# EAGLE design LEDArray1 (EAGLE 6.0)
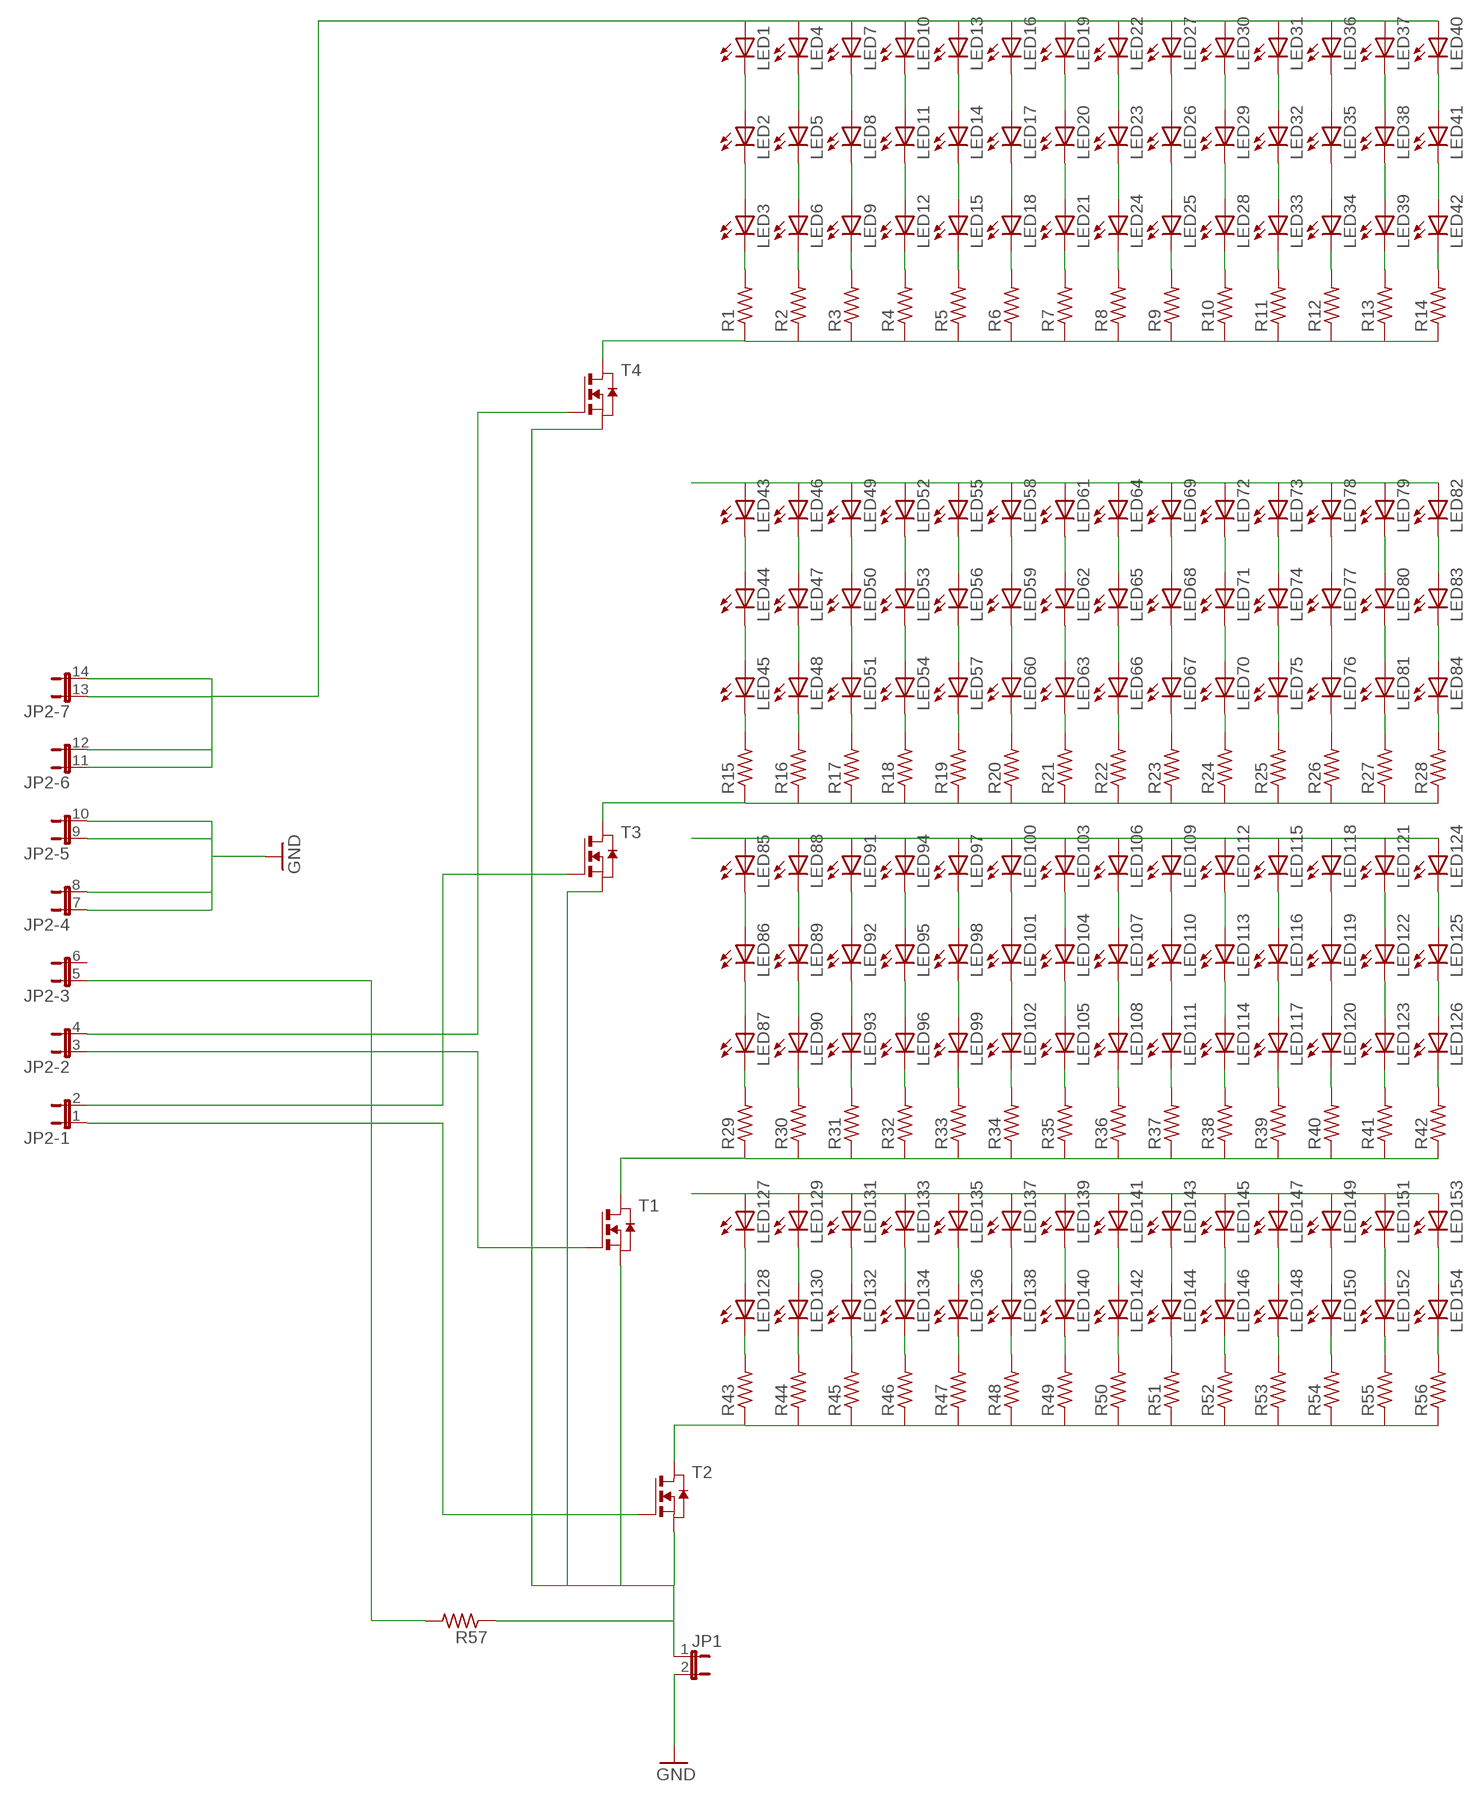
[diagram p0: schematic, sheet 1]

## Parts
JP1  JP1E  [JP1]
JP2  JP7QE  [JP7Q]
LED1  LED5MM  [LED5MM]
LED2  LED5MM  [LED5MM]
LED3  LED5MM  [LED5MM]
LED4  LED5MM  [LED5MM]
LED5  LED5MM  [LED5MM]
LED6  LED5MM  [LED5MM]
LED7  LED5MM  [LED5MM]
LED8  LED5MM  [LED5MM]
LED9  LED5MM  [LED5MM]
LED10  LED5MM  [LED5MM]
LED11  LED5MM  [LED5MM]
LED12  LED5MM  [LED5MM]
LED13  LED5MM  [LED5MM]
LED14  LED5MM  [LED5MM]
LED15  LED5MM  [LED5MM]
LED16  LED5MM  [LED5MM]
LED17  LED5MM  [LED5MM]
LED18  LED5MM  [LED5MM]
LED19  LED5MM  [LED5MM]
LED20  LED5MM  [LED5MM]
LED21  LED5MM  [LED5MM]
LED22  LED5MM  [LED5MM]
LED23  LED5MM  [LED5MM]
LED24  LED5MM  [LED5MM]
LED25  LED5MM  [LED5MM]
LED26  LED5MM  [LED5MM]
LED27  LED5MM  [LED5MM]
LED28  LED5MM  [LED5MM]
LED29  LED5MM  [LED5MM]
LED30  LED5MM  [LED5MM]
LED31  LED5MM  [LED5MM]
LED32  LED5MM  [LED5MM]
LED33  LED5MM  [LED5MM]
LED34  LED5MM  [LED5MM]
LED35  LED5MM  [LED5MM]
LED36  LED5MM  [LED5MM]
LED37  LED5MM  [LED5MM]
LED38  LED5MM  [LED5MM]
LED39  LED5MM  [LED5MM]
LED40  LED5MM  [LED5MM]
LED41  LED5MM  [LED5MM]
LED42  LED5MM  [LED5MM]
LED43  LED5MM  [LED5MM]
LED44  LED5MM  [LED5MM]
LED45  LED5MM  [LED5MM]
LED46  LED5MM  [LED5MM]
LED47  LED5MM  [LED5MM]
LED48  LED5MM  [LED5MM]
LED49  LED5MM  [LED5MM]
LED50  LED5MM  [LED5MM]
LED51  LED5MM  [LED5MM]
LED52  LED5MM  [LED5MM]
LED53  LED5MM  [LED5MM]
LED54  LED5MM  [LED5MM]
LED55  LED5MM  [LED5MM]
LED56  LED5MM  [LED5MM]
LED57  LED5MM  [LED5MM]
LED58  LED5MM  [LED5MM]
LED59  LED5MM  [LED5MM]
LED60  LED5MM  [LED5MM]
LED61  LED5MM  [LED5MM]
LED62  LED5MM  [LED5MM]
LED63  LED5MM  [LED5MM]
LED64  LED5MM  [LED5MM]
LED65  LED5MM  [LED5MM]
LED66  LED5MM  [LED5MM]
LED67  LED5MM  [LED5MM]
LED68  LED5MM  [LED5MM]
LED69  LED5MM  [LED5MM]
LED70  LED5MM  [LED5MM]
LED71  LED5MM  [LED5MM]
LED72  LED5MM  [LED5MM]
LED73  LED5MM  [LED5MM]
LED74  LED5MM  [LED5MM]
LED75  LED5MM  [LED5MM]
LED76  LED5MM  [LED5MM]
LED77  LED5MM  [LED5MM]
LED78  LED5MM  [LED5MM]
LED79  LED5MM  [LED5MM]
LED80  LED5MM  [LED5MM]
LED81  LED5MM  [LED5MM]
LED82  LED5MM  [LED5MM]
LED83  LED5MM  [LED5MM]
LED84  LED5MM  [LED5MM]
LED85  LED5MM  [LED5MM]
LED86  LED5MM  [LED5MM]
LED87  LED5MM  [LED5MM]
LED88  LED5MM  [LED5MM]
LED89  LED5MM  [LED5MM]
LED90  LED5MM  [LED5MM]
LED91  LED5MM  [LED5MM]
LED92  LED5MM  [LED5MM]
LED93  LED5MM  [LED5MM]
LED94  LED5MM  [LED5MM]
LED95  LED5MM  [LED5MM]
LED96  LED5MM  [LED5MM]
LED97  LED5MM  [LED5MM]
LED98  LED5MM  [LED5MM]
LED99  LED5MM  [LED5MM]
LED100  LED5MM  [LED5MM]
LED101  LED5MM  [LED5MM]
LED102  LED5MM  [LED5MM]
LED103  LED5MM  [LED5MM]
LED104  LED5MM  [LED5MM]
LED105  LED5MM  [LED5MM]
LED106  LED5MM  [LED5MM]
LED107  LED5MM  [LED5MM]
LED108  LED5MM  [LED5MM]
LED109  LED5MM  [LED5MM]
LED110  LED5MM  [LED5MM]
LED111  LED5MM  [LED5MM]
LED112  LED5MM  [LED5MM]
LED113  LED5MM  [LED5MM]
LED114  LED5MM  [LED5MM]
LED115  LED5MM  [LED5MM]
LED116  LED5MM  [LED5MM]
LED117  LED5MM  [LED5MM]
LED118  LED5MM  [LED5MM]
LED119  LED5MM  [LED5MM]
LED120  LED5MM  [LED5MM]
LED121  LED5MM  [LED5MM]
LED122  LED5MM  [LED5MM]
LED123  LED5MM  [LED5MM]
LED124  LED5MM  [LED5MM]
LED125  LED5MM  [LED5MM]
LED126  LED5MM  [LED5MM]
LED127  LED5MM  [LED5MM]
LED128  LED5MM  [LED5MM]
LED129  LED5MM  [LED5MM]
LED130  LED5MM  [LED5MM]
LED131  LED5MM  [LED5MM]
LED132  LED5MM  [LED5MM]
LED133  LED5MM  [LED5MM]
LED134  LED5MM  [LED5MM]
LED135  LED5MM  [LED5MM]
LED136  LED5MM  [LED5MM]
LED137  LED5MM  [LED5MM]
LED138  LED5MM  [LED5MM]
LED139  LED5MM  [LED5MM]
LED140  LED5MM  [LED5MM]
LED141  LED5MM  [LED5MM]
LED142  LED5MM  [LED5MM]
LED143  LED5MM  [LED5MM]
LED144  LED5MM  [LED5MM]
LED145  LED5MM  [LED5MM]
LED146  LED5MM  [LED5MM]
LED147  LED5MM  [LED5MM]
LED148  LED5MM  [LED5MM]
LED149  LED5MM  [LED5MM]
LED150  LED5MM  [LED5MM]
LED151  LED5MM  [LED5MM]
LED152  LED5MM  [LED5MM]
LED153  LED5MM  [LED5MM]
LED154  LED5MM  [LED5MM]
R1  R-US_R0805  [R0805]
R2  R-US_R0805  [R0805]
R3  R-US_R0805  [R0805]
R4  R-US_R0805  [R0805]
R5  R-US_R0805  [R0805]
R6  R-US_R0805  [R0805]
R7  R-US_R0805  [R0805]
R8  R-US_R0805  [R0805]
R9  R-US_R0805  [R0805]
R10  R-US_R0805  [R0805]
R11  R-US_R0805  [R0805]
R12  R-US_R0805  [R0805]
R13  R-US_R0805  [R0805]
R14  R-US_R0805  [R0805]
R15  R-US_R0805  [R0805]
R16  R-US_R0805  [R0805]
R17  R-US_R0805  [R0805]
R18  R-US_R0805  [R0805]
R19  R-US_R0805  [R0805]
R20  R-US_R0805  [R0805]
R21  R-US_R0805  [R0805]
R22  R-US_R0805  [R0805]
R23  R-US_R0805  [R0805]
R24  R-US_R0805  [R0805]
R25  R-US_R0805  [R0805]
R26  R-US_R0805  [R0805]
R27  R-US_R0805  [R0805]
R28  R-US_R0805  [R0805]
R29  R-US_R0805  [R0805]
R30  R-US_R0805  [R0805]
R31  R-US_R0805  [R0805]
R32  R-US_R0805  [R0805]
R33  R-US_R0805  [R0805]
R34  R-US_R0805  [R0805]
R35  R-US_R0805  [R0805]
R36  R-US_R0805  [R0805]
R37  R-US_R0805  [R0805]
R38  R-US_R0805  [R0805]
R39  R-US_R0805  [R0805]
R40  R-US_R0805  [R0805]
R41  R-US_R0805  [R0805]
R42  R-US_R0805  [R0805]
R43  R-US_R0805  [R0805]
R44  R-US_R0805  [R0805]
R45  R-US_R0805  [R0805]
R46  R-US_R0805  [R0805]
R47  R-US_R0805  [R0805]
R48  R-US_R0805  [R0805]
R49  R-US_R0805  [R0805]
R50  R-US_R0805  [R0805]
R51  R-US_R0805  [R0805]
R52  R-US_R0805  [R0805]
R53  R-US_R0805  [R0805]
R54  R-US_R0805  [R0805]
R55  R-US_R0805  [R0805]
R56  R-US_R0805  [R0805]
R57  R-US_R0805  [R0805]
T1  NMOSSOT23  [SOT-23]
T2  NMOSSOT23  [SOT-23]
T3  NMOSSOT23  [SOT-23]
T4  NMOSSOT23  [SOT-23]

## Nets
GND: JP1.2 JP2.7 JP2.8 JP2.9 JP2.10
N$1: LED1.K(C) LED2.A
N$2: LED4.K(C) LED5.A
N$3: LED7.K(C) LED8.A
N$4: LED10.K(C) LED11.A
N$5: LED13.K(C) LED14.A
N$6: LED16.K(C) LED17.A
N$7: LED19.K(C) LED20.A
N$8: LED22.K(C) LED23.A
N$9: LED26.A LED27.K(C)
N$10: LED29.A LED30.K(C)
N$11: LED31.K(C) LED32.A
N$12: LED35.A LED36.K(C)
N$13: LED37.K(C) LED38.A
N$14: LED40.K(C) LED41.A
N$15: LED41.K(C) LED42.A
N$16: LED38.K(C) LED39.A
N$17: LED34.A LED35.K(C)
N$18: LED32.K(C) LED33.A
N$19: LED28.A LED29.K(C)
N$20: LED25.A LED26.K(C)
N$21: LED23.K(C) LED24.A
N$22: LED20.K(C) LED21.A
N$23: LED17.K(C) LED18.A
N$24: LED14.K(C) LED15.A
N$25: LED11.K(C) LED12.A
N$26: LED8.K(C) LED9.A
N$27: LED5.K(C) LED6.A
N$28: LED2.K(C) LED3.A
N$29: R1.1 R2.1 R3.1 R4.1 R5.1 R6.1 R7.1 R8.1 R9.1 R10.1 R11.1 R12.1 R13.1 R14.1 T4.1(D)
N$30: LED43.K(C) LED44.A
N$31: LED46.K(C) LED47.A
N$32: LED49.K(C) LED50.A
N$33: LED52.K(C) LED53.A
N$34: LED55.K(C) LED56.A
N$35: LED58.K(C) LED59.A
N$36: LED61.K(C) LED62.A
N$37: LED64.K(C) LED65.A
N$38: LED68.A LED69.K(C)
N$39: LED71.A LED72.K(C)
N$40: LED73.K(C) LED74.A
N$41: LED77.A LED78.K(C)
N$42: LED79.K(C) LED80.A
N$43: LED82.K(C) LED83.A
N$44: LED83.K(C) LED84.A
N$45: LED80.K(C) LED81.A
N$46: LED76.A LED77.K(C)
N$47: LED74.K(C) LED75.A
N$48: LED70.A LED71.K(C)
N$49: LED67.A LED68.K(C)
N$50: LED65.K(C) LED66.A
N$51: LED62.K(C) LED63.A
N$52: LED59.K(C) LED60.A
N$53: LED56.K(C) LED57.A
N$54: LED53.K(C) LED54.A
N$55: LED50.K(C) LED51.A
N$56: LED47.K(C) LED48.A
N$57: LED44.K(C) LED45.A
N$58: R15.1 R16.1 R17.1 R18.1 R19.1 R20.1 R21.1 R22.1 R23.1 R24.1 R25.1 R26.1 R27.1 R28.1 T3.1(D)
N$59: LED85.K(C) LED86.A
N$60: LED86.K(C) LED87.A
N$61: LED88.K(C) LED89.A
N$62: LED91.K(C) LED92.A
N$63: LED94.K(C) LED95.A
N$64: LED97.K(C) LED98.A
N$65: LED100.K(C) LED101.A
N$66: LED103.K(C) LED104.A
N$67: LED106.K(C) LED107.A
N$68: LED109.K(C) LED110.A
N$69: LED112.K(C) LED113.A
N$70: LED115.K(C) LED116.A
N$71: LED118.K(C) LED119.A
N$72: LED121.K(C) LED122.A
N$73: LED124.K(C) LED125.A
N$74: LED125.K(C) LED126.A
N$75: LED122.K(C) LED123.A
N$76: LED119.K(C) LED120.A
N$77: LED116.K(C) LED117.A
N$78: LED113.K(C) LED114.A
N$79: LED110.K(C) LED111.A
N$80: LED107.K(C) LED108.A
N$81: LED104.K(C) LED105.A
N$82: LED101.K(C) LED102.A
N$83: LED98.K(C) LED99.A
N$84: LED95.K(C) LED96.A
N$85: LED92.K(C) LED93.A
N$86: LED89.K(C) LED90.A
N$87: R29.1 R30.1 R31.1 R32.1 R33.1 R34.1 R35.1 R36.1 R37.1 R38.1 R39.1 R40.1 R41.1 R42.1 T1.1(D)
N$88: LED127.K(C) LED128.A
N$89: LED129.K(C) LED130.A
N$90: LED131.K(C) LED132.A
N$91: LED133.K(C) LED134.A
N$92: LED135.K(C) LED136.A
N$93: LED137.K(C) LED138.A
N$94: LED139.K(C) LED140.A
N$95: LED141.K(C) LED142.A
N$96: LED143.K(C) LED144.A
N$97: LED145.K(C) LED146.A
N$98: LED147.K(C) LED148.A
N$99: LED149.K(C) LED150.A
N$100: LED151.K(C) LED152.A
N$101: LED153.K(C) LED154.A
N$102: R43.1 R44.1 R45.1 R46.1 R47.1 R48.1 R49.1 R50.1 R51.1 R52.1 R53.1 R54.1 R55.1 R56.1 T2.1(D)
N$103: JP2.3 T1.3(G)
N$104: JP2.5 R57.2
N$106: LED42.K(C) R14.2
N$107: LED39.K(C) R13.2
N$108: LED34.K(C) R12.2
N$109: LED33.K(C) R11.2
N$110: LED28.K(C) R10.2
N$111: LED25.K(C) R9.2
N$112: LED24.K(C) R8.2
N$113: LED21.K(C) R7.2
N$114: LED18.K(C) R6.2
N$115: LED15.K(C) R5.2
N$116: LED12.K(C) R4.2
N$117: LED9.K(C) R3.2
N$118: LED6.K(C) R2.2
N$119: LED3.K(C) R1.2
N$120: LED45.K(C) R15.2
N$121: LED48.K(C) R16.2
N$122: LED51.K(C) R17.2
N$123: LED54.K(C) R18.2
N$124: LED57.K(C) R19.2
N$125: LED60.K(C) R20.2
N$126: LED63.K(C) R21.2
N$127: LED66.K(C) R22.2
N$128: LED67.K(C) R23.2
N$129: LED70.K(C) R24.2
N$130: LED75.K(C) R25.2
N$131: LED76.K(C) R26.2
N$132: LED81.K(C) R27.2
N$133: LED84.K(C) R28.2
N$134: LED87.K(C) R29.2
N$135: LED90.K(C) R30.2
N$136: LED93.K(C) R31.2
N$137: LED96.K(C) R32.2
N$138: LED99.K(C) R33.2
N$139: LED102.K(C) R34.2
N$140: LED105.K(C) R35.2
N$141: LED108.K(C) R36.2
N$142: LED111.K(C) R37.2
N$143: LED114.K(C) R38.2
N$144: LED117.K(C) R39.2
N$145: LED120.K(C) R40.2
N$146: LED123.K(C) R41.2
N$147: LED126.K(C) R42.2
N$148: LED128.K(C) R43.2
N$149: LED130.K(C) R44.2
N$150: LED132.K(C) R45.2
N$151: LED134.K(C) R46.2
N$152: LED136.K(C) R47.2
N$153: LED138.K(C) R48.2
N$154: LED140.K(C) R49.2
N$155: LED142.K(C) R50.2
N$156: LED144.K(C) R51.2
N$157: LED146.K(C) R52.2
N$158: LED148.K(C) R53.2
N$159: LED150.K(C) R54.2
N$160: LED152.K(C) R55.2
N$161: LED154.K(C) R56.2
N$163: JP2.1 T2.3(G)
N$165: JP1.1 R57.1 T1.2(S) T2.2(S) T3.2(S) T4.2(S)
N$166: JP2.2 T3.3(G)
N$167: JP2.4 T4.3(G)
VCC: JP2.11 JP2.12 JP2.13 JP2.14 LED1.A LED4.A LED7.A LED10.A LED13.A LED16.A LED19.A LED22.A LED27.A LED30.A LED31.A LED36.A LED37.A LED40.A LED43.A LED46.A LED49.A LED52.A LED55.A LED58.A LED61.A LED64.A LED69.A LED72.A LED73.A LED78.A LED79.A LED82.A LED85.A LED88.A LED91.A LED94.A LED97.A LED100.A LED103.A LED106.A LED109.A LED112.A LED115.A LED118.A LED121.A LED124.A LED127.A LED129.A LED131.A LED133.A LED135.A LED137.A LED139.A LED141.A LED143.A LED145.A LED147.A LED149.A LED151.A LED153.A
Unconnected: JP2.6

## Library data of the parts
JP1 = jumper:JP1E: JUMPER
JP2 = jumper:JP7QE: JUMPER
LED1-LED154 = led:LED: LED OSRAM: - CHIPLED LG R971, LG N971, LY N971, LG Q971, LY Q971, LO R971, LY R971 LH N974, LH R974 LS Q976, LO Q976, LY Q976 LO Q996 - Hyper CHIPLED LW Q18S LB Q993, LB Q99A, LB R99A - SideLED LS A670, LO A670, LY A670, LG A670, LP A670 LB A673, LV A673, LT A673, LW A673 LH A674 LY A675 LS A676, LA A676, LO A676, LY A676, LW A676 LS A679, LY A679, LG A679 - Hyper Micro SIDELED® LS Y876, LA Y876, LO Y876, LY Y876 LT Y87S - SmartLED LW L88C, LW L88S LB L89C, LB L89S, LG L890 LS L89K, LO L89K, LY L89K LS L896, LA L896, LO L896, LY L896 - TOPLED LS T670, LO T670, LY T670, LG T670, LP T670 LSG T670, LSP T670, LSY T670, LOP T670, LYG T670 LG T671, LOG T671, LSG T671 LB T673, LV T673, LT T673, LW T673 LH T674 LS T676, LA T676, LO T676, LY T676, LB T676, LH T676, LSB T676, LW T676 LB T67C, LV T67C, LT T67C, LS T67K, LO T67K, LY T67K, LW E67C LS E67B, LA E67B, LO E67B, LY E67B, LB E67C, LV E67C, LT E67C LW T67C LS T679, LY T679, LG T679 LS T770, LO T770, LY T770, LG T770, LP T770 LB T773, LV T773, LT T773, LW T773 LH T774 LS E675, LA E675, LY E675, LS T675 LS T776, LA T776, LO T776, LY T776, LB T776 LHGB T686 LT T68C, LB T68C - Hyper Mini TOPLED® LB M676 - Mini TOPLED Santana® LG M470 LS M47K, LO M47K, LY M47K Source: http://www.osram.convergy.de LUXEON: - LUMILED® LXK2-PW12-R00, LXK2-PW12-S00, LXK2-PW14-U00, LXK2-PW14-V00 LXK2-PM12-R00, LXK2-PM12-S00, LXK2-PM14-U00 LXK2-PE12-Q00, LXK2-PE12-R00, LXK2-PE12-S00, LXK2-PE14-T00, LXK2-PE14-U00 LXK2-PB12-K00, LXK2-PB12-L00, LXK2-PB12-M00, LXK2-PB14-N00, LXK2-PB14-P00, LXK2-PB14-Q00 LXK2-PR12-L00, LXK2-PR12-M00, LXK2-PR14-Q00, LXK2-PR14-R00 LXK2-PD12-Q00, LXK2-PD12-R00, LXK2-PD12-S00 LXK2-PH12-R00, LXK2-PH12-S00 LXK2-PL12-P00, LXK2-PL12-Q00, LXK2-PL12-R00 Source: www.luxeon.com KINGBRIGHT: KA-3528ASYC Source: www.kingbright.com
R1-R57 = rcl:R-US_: RESISTOR, American symbol
T1-T4 = zetex:NMOSSOT23: MOS FET; OC_FARNELL: unknown; OC_NEWARK: unknown

## Board
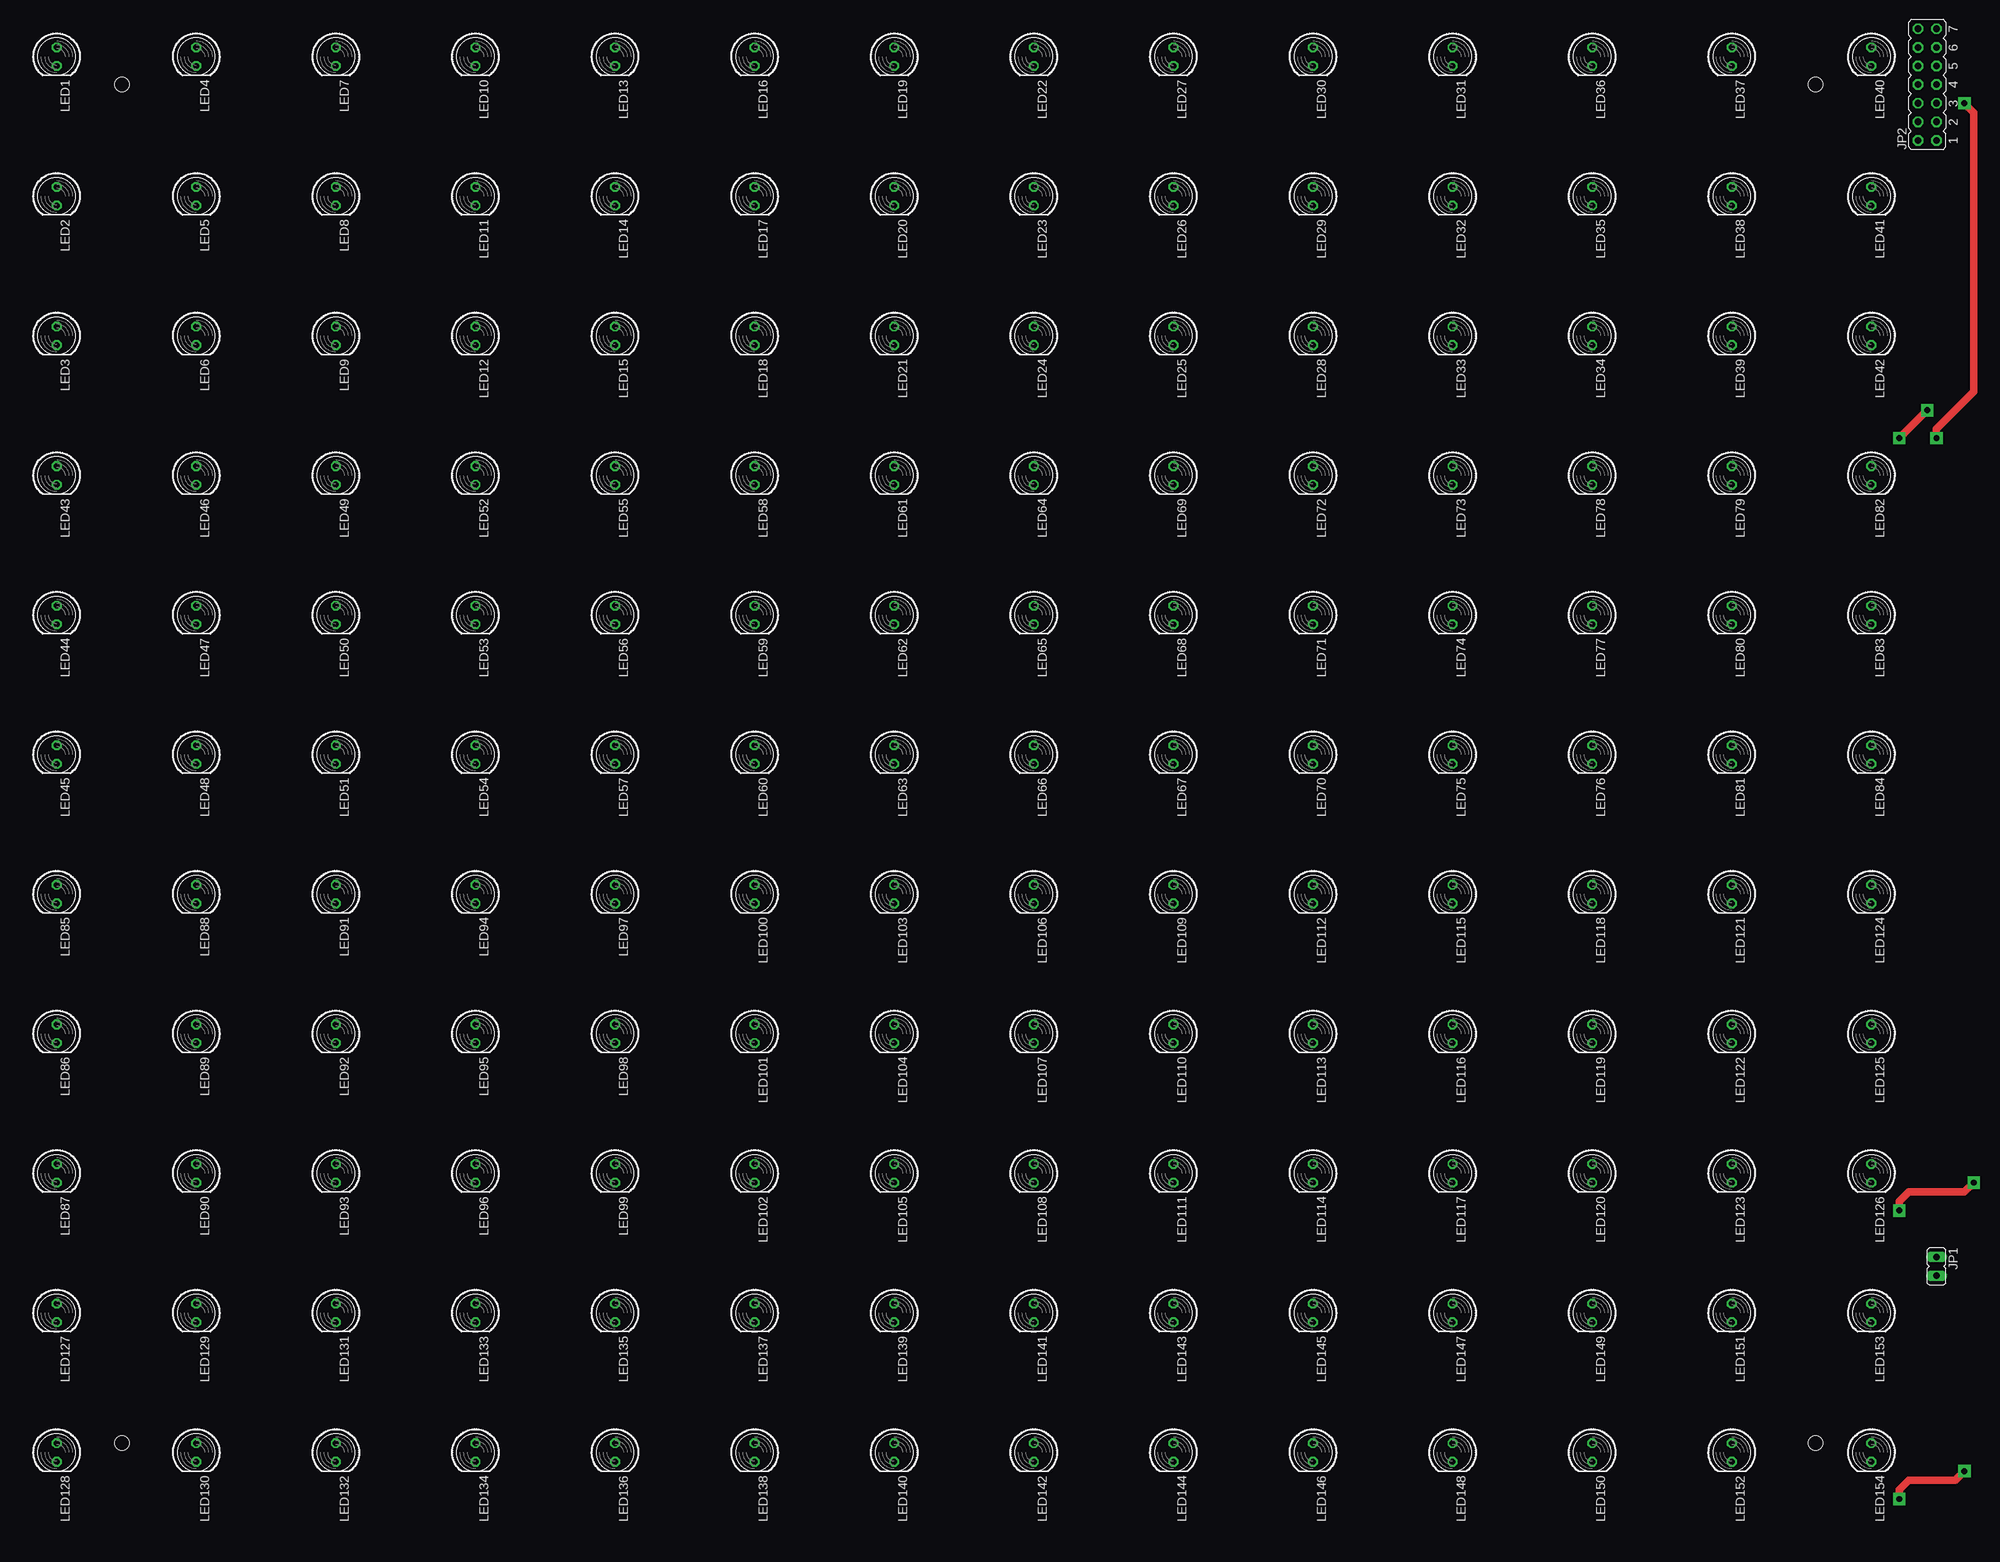
[diagram p1: board, top side]
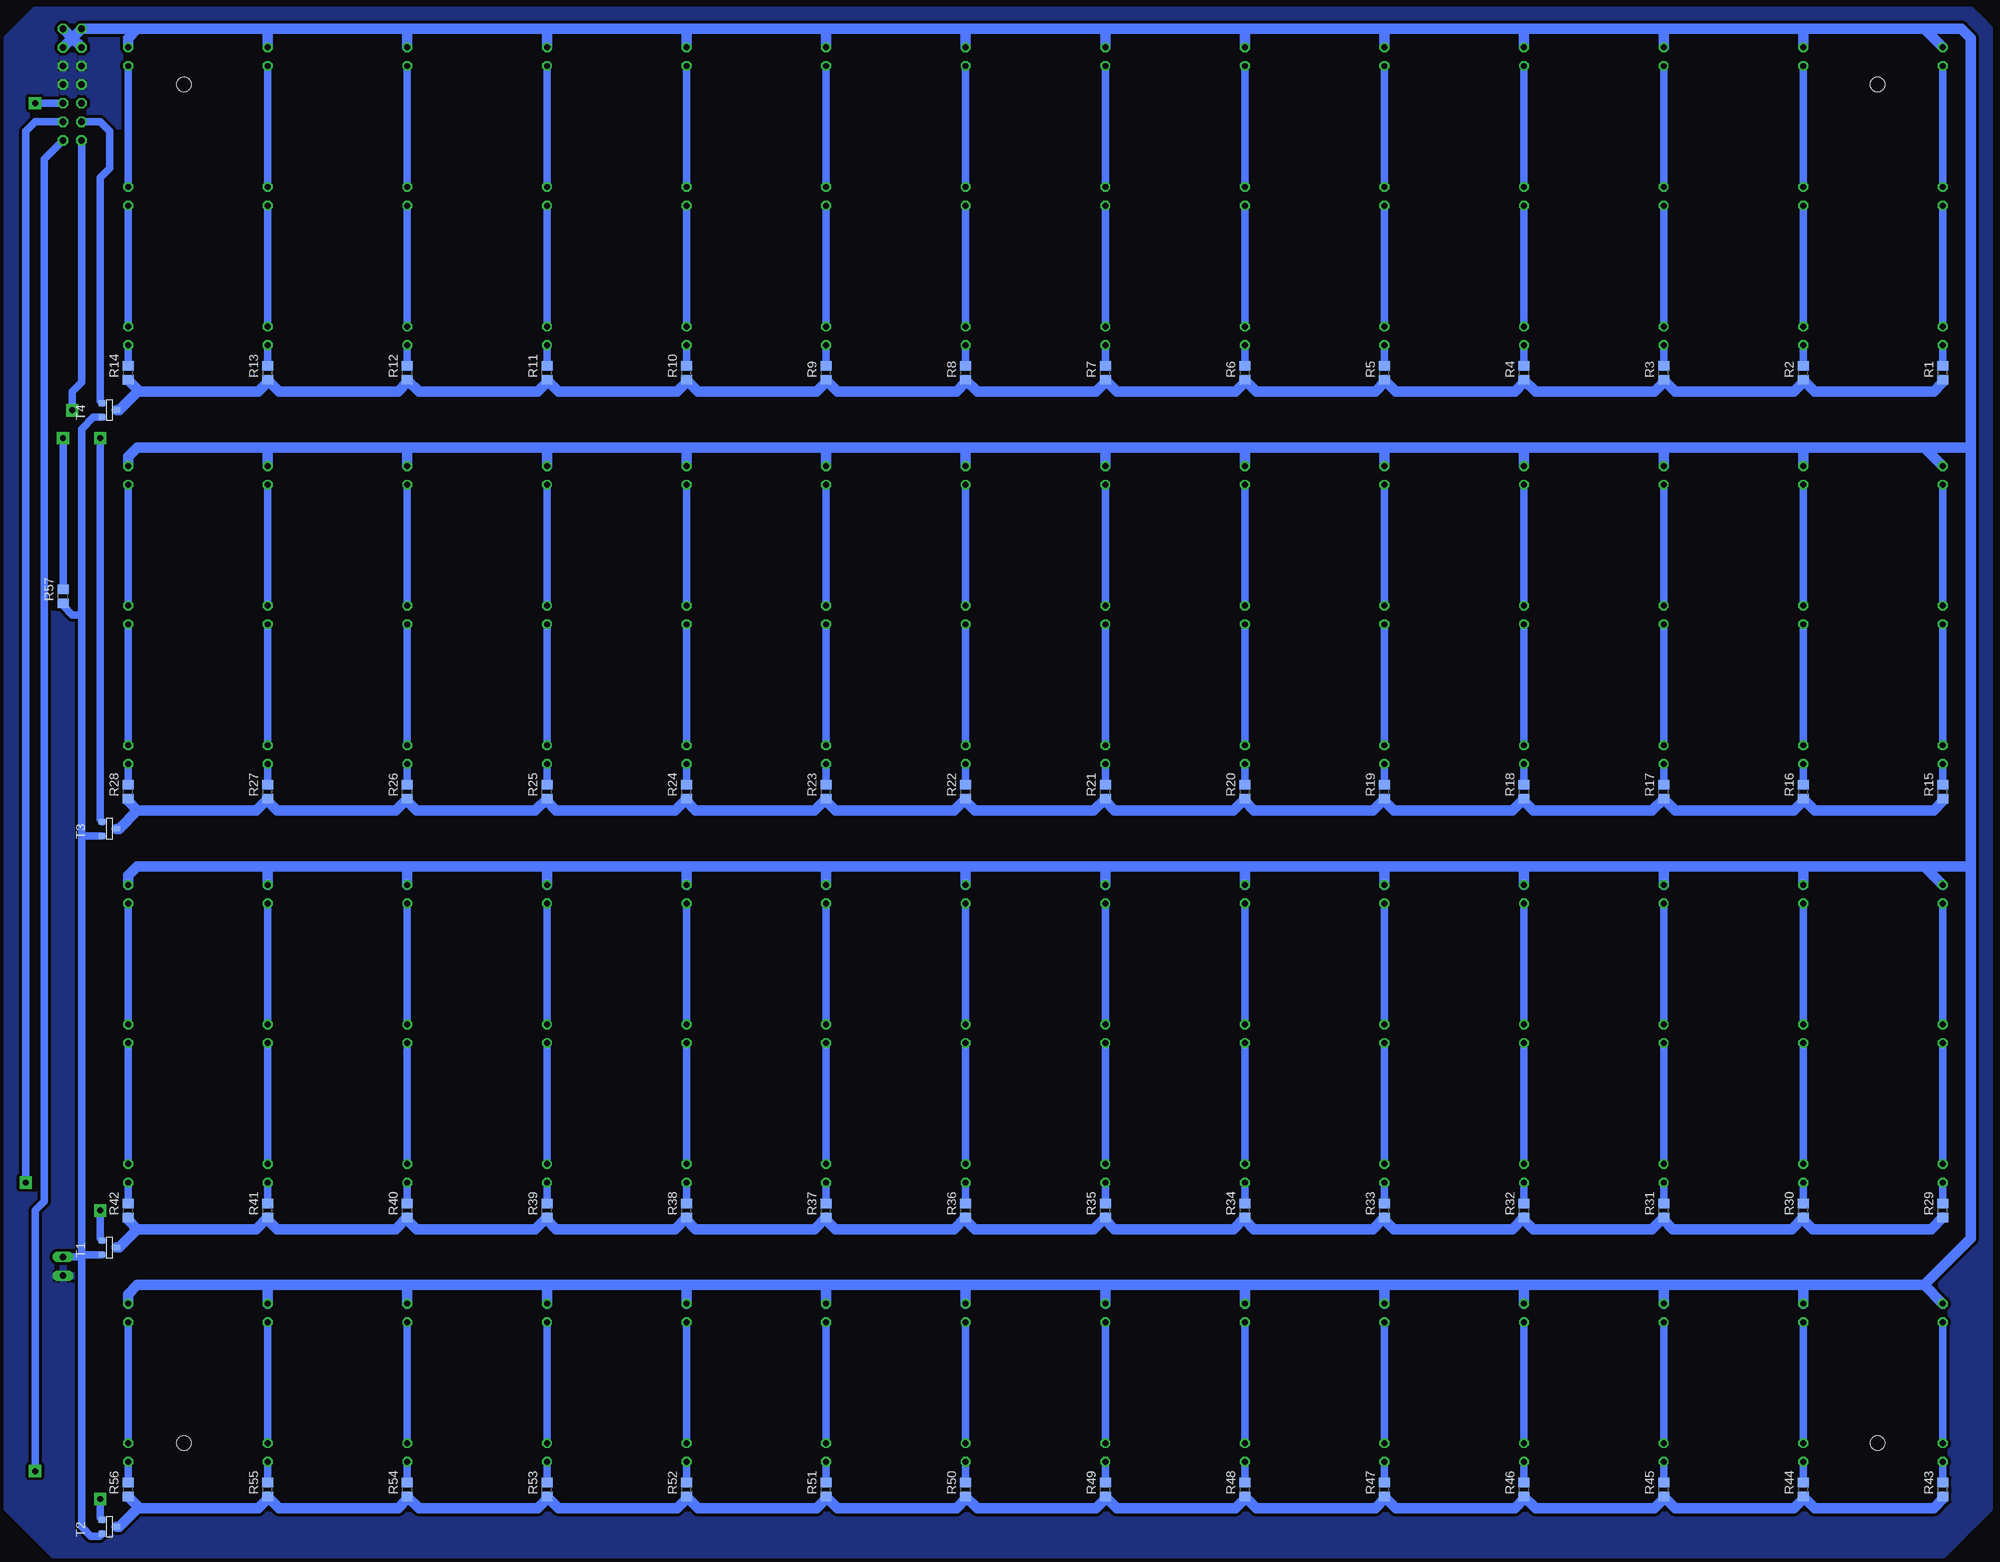
[diagram p2: board, bottom side, seen from below]

No outline drawn. Coordinates in mm, seen from the top.
Copper layers (1*16): Top 0.035mm / dielectric 1.5mm / Bottom 0.035mm
Design rules: minimum track width 10mil, minimum drill 24mil, track to track 8mil, track to pad 8mil, pad to pad 8mil, via to via 8mil, smd to smd 8mil, copper to edge 40mil, drill to drill 8mil, minimum pad ring 10mil, minimum via ring 8mil, stop-mask expansion 4mil, vias tented up to drill 0mil, thermal gap 10mil
Holes 2 mm at 27.94,224.79 27.94,39.37 259.08,39.37 259.08,224.79

### Footprints (pad centres in the part's own frame; a part is rotated, then mirrored left to right if it is on the bottom)
JP1 = drill 0.914 long: 1 0,-1.27; 2 0,1.27
JP7Q = drill 0.914 octagon: 1 -7.62,-1.27; 2 -7.62,1.27; 3 -5.08,-1.27; 4 -5.08,1.27; 5 -2.54,-1.27; 6 -2.54,1.27; 7 0,-1.27; 8 0,1.27; 9 2.54,-1.27; 10 2.54,1.27; 11 5.08,-1.27; 12 5.08,1.27; 13 7.62,-1.27; 14 7.62,1.27
LED5MM = drill 0.813 octagon: A -1.27,0; K 1.27,0
R0805 = smd 1.3 x 1.5: 1 -0.95,0; 2 0.95,0
SOT-23 = smd 0.787 x 0.889: 1 0.025,-1.016; 2 -0.94,1.016; 3 0.991,1.016

### Placement (x,y rotation side)
JP1  275.59,63.5 180 top
JP2  274.32,224.79 90 top
LED1  19.05,228.6 270 top
LED2  19.05,209.55 270 top
LED3  19.05,190.5 270 top
LED4  38.1,228.6 270 top
LED5  38.1,209.55 270 top
LED6  38.1,190.5 270 top
LED7  57.15,228.6 270 top
LED8  57.15,209.55 270 top
LED9  57.15,190.5 270 top
LED10  76.2,228.6 270 top
LED11  76.2,209.55 270 top
LED12  76.2,190.5 270 top
LED13  95.25,228.6 270 top
LED14  95.25,209.55 270 top
LED15  95.25,190.5 270 top
LED16  114.3,228.6 270 top
LED17  114.3,209.55 270 top
LED18  114.3,190.5 270 top
LED19  133.35,228.6 270 top
LED20  133.35,209.55 270 top
LED21  133.35,190.5 270 top
LED22  152.4,228.6 270 top
LED23  152.4,209.55 270 top
LED24  152.4,190.5 270 top
LED25  171.45,190.5 270 top
LED26  171.45,209.55 270 top
LED27  171.45,228.6 270 top
LED28  190.5,190.5 270 top
LED29  190.5,209.55 270 top
LED30  190.5,228.6 270 top
LED31  209.55,228.6 270 top
LED32  209.55,209.55 270 top
LED33  209.55,190.5 270 top
LED34  228.6,190.5 270 top
LED35  228.6,209.55 270 top
LED36  228.6,228.6 270 top
LED37  247.65,228.6 270 top
LED38  247.65,209.55 270 top
LED39  247.65,190.5 270 top
LED40  266.7,228.6 270 top
LED41  266.7,209.55 270 top
LED42  266.7,190.5 270 top
LED43  19.05,171.45 270 top
LED44  19.05,152.4 270 top
LED45  19.05,133.35 270 top
LED46  38.1,171.45 270 top
LED47  38.1,152.4 270 top
LED48  38.1,133.35 270 top
LED49  57.15,171.45 270 top
LED50  57.15,152.4 270 top
LED51  57.15,133.35 270 top
LED52  76.2,171.45 270 top
LED53  76.2,152.4 270 top
LED54  76.2,133.35 270 top
LED55  95.25,171.45 270 top
LED56  95.25,152.4 270 top
LED57  95.25,133.35 270 top
LED58  114.3,171.45 270 top
LED59  114.3,152.4 270 top
LED60  114.3,133.35 270 top
LED61  133.35,171.45 270 top
LED62  133.35,152.4 270 top
LED63  133.35,133.35 270 top
LED64  152.4,171.45 270 top
LED65  152.4,152.4 270 top
LED66  152.4,133.35 270 top
LED67  171.45,133.35 270 top
LED68  171.45,152.4 270 top
LED69  171.45,171.45 270 top
LED70  190.5,133.35 270 top
LED71  190.5,152.4 270 top
LED72  190.5,171.45 270 top
LED73  209.55,171.45 270 top
LED74  209.55,152.4 270 top
LED75  209.55,133.35 270 top
LED76  228.6,133.35 270 top
LED77  228.6,152.4 270 top
LED78  228.6,171.45 270 top
LED79  247.65,171.45 270 top
LED80  247.65,152.4 270 top
LED81  247.65,133.35 270 top
LED82  266.7,171.45 270 top
LED83  266.7,152.4 270 top
LED84  266.7,133.35 270 top
LED85  19.05,114.3 270 top
LED86  19.05,95.25 270 top
LED87  19.05,76.2 270 top
LED88  38.1,114.3 270 top
LED89  38.1,95.25 270 top
LED90  38.1,76.2 270 top
LED91  57.15,114.3 270 top
LED92  57.15,95.25 270 top
LED93  57.15,76.2 270 top
LED94  76.2,114.3 270 top
LED95  76.2,95.25 270 top
LED96  76.2,76.2 270 top
LED97  95.25,114.3 270 top
LED98  95.25,95.25 270 top
LED99  95.25,76.2 270 top
LED100  114.3,114.3 270 top
LED101  114.3,95.25 270 top
LED102  114.3,76.2 270 top
LED103  133.35,114.3 270 top
LED104  133.35,95.25 270 top
LED105  133.35,76.2 270 top
LED106  152.4,114.3 270 top
LED107  152.4,95.25 270 top
LED108  152.4,76.2 270 top
LED109  171.45,114.3 270 top
LED110  171.45,95.25 270 top
LED111  171.45,76.2 270 top
LED112  190.5,114.3 270 top
LED113  190.5,95.25 270 top
LED114  190.5,76.2 270 top
LED115  209.55,114.3 270 top
LED116  209.55,95.25 270 top
LED117  209.55,76.2 270 top
LED118  228.6,114.3 270 top
LED119  228.6,95.25 270 top
LED120  228.6,76.2 270 top
LED121  247.65,114.3 270 top
LED122  247.65,95.25 270 top
LED123  247.65,76.2 270 top
LED124  266.7,114.3 270 top
LED125  266.7,95.25 270 top
LED126  266.7,76.2 270 top
LED127  19.05,57.15 270 top
LED128  19.05,38.1 270 top
LED129  38.1,57.15 270 top
LED130  38.1,38.1 270 top
LED131  57.15,57.15 270 top
LED132  57.15,38.1 270 top
LED133  76.2,57.15 270 top
LED134  76.2,38.1 270 top
LED135  95.25,57.15 270 top
LED136  95.25,38.1 270 top
LED137  114.3,57.15 270 top
LED138  114.3,38.1 270 top
LED139  133.35,57.15 270 top
LED140  133.35,38.1 270 top
LED141  152.4,57.15 270 top
LED142  152.4,38.1 270 top
LED143  171.45,57.15 270 top
LED144  171.45,38.1 270 top
LED145  190.5,57.15 270 top
LED146  190.5,38.1 270 top
LED147  209.55,57.15 270 top
LED148  209.55,38.1 270 top
LED149  228.6,57.15 270 top
LED150  228.6,38.1 270 top
LED151  247.65,57.15 270 top
LED152  247.65,38.1 270 top
LED153  266.7,57.15 270 top
LED154  266.7,38.1 270 top
R1  19.05,185.42 90 bottom
R2  38.1,185.42 90 bottom
R3  57.15,185.42 90 bottom
R4  76.2,185.42 90 bottom
R5  95.25,185.42 90 bottom
R6  114.3,185.42 90 bottom
R7  133.35,185.42 90 bottom
R8  152.4,185.42 90 bottom
R9  171.45,185.42 90 bottom
R10  190.5,185.42 90 bottom
R11  209.55,185.42 90 bottom
R12  228.6,185.42 90 bottom
R13  247.65,185.42 90 bottom
R14  266.7,185.42 90 bottom
R15  19.05,128.27 90 bottom
R16  38.1,128.27 90 bottom
R17  57.15,128.27 90 bottom
R18  76.2,128.27 90 bottom
R19  95.25,128.27 90 bottom
R20  114.3,128.27 90 bottom
R21  133.35,128.27 90 bottom
R22  152.4,128.27 90 bottom
R23  171.45,128.27 90 bottom
R24  190.5,128.27 90 bottom
R25  209.55,128.27 90 bottom
R26  228.6,128.27 90 bottom
R27  247.65,128.27 90 bottom
R28  266.7,128.27 90 bottom
R29  19.05,71.12 90 bottom
R30  38.1,71.12 90 bottom
R31  57.15,71.12 90 bottom
R32  76.2,71.12 90 bottom
R33  95.25,71.12 90 bottom
R34  114.3,71.12 90 bottom
R35  133.35,71.12 90 bottom
R36  152.4,71.12 90 bottom
R37  171.45,71.12 90 bottom
R38  190.5,71.12 90 bottom
R39  209.55,71.12 90 bottom
R40  228.6,71.12 90 bottom
R41  247.65,71.12 90 bottom
R42  266.7,71.12 90 bottom
R43  19.05,33.02 90 bottom
R44  38.1,33.02 90 bottom
R45  57.15,33.02 90 bottom
R46  76.2,33.02 90 bottom
R47  95.25,33.02 90 bottom
R48  114.3,33.02 90 bottom
R49  133.35,33.02 90 bottom
R50  152.4,33.02 90 bottom
R51  171.45,33.02 90 bottom
R52  190.5,33.02 90 bottom
R53  209.55,33.02 90 bottom
R54  228.6,33.02 90 bottom
R55  247.65,33.02 90 bottom
R56  266.7,33.02 90 bottom
R57  275.59,154.94 90 bottom
T1  269.24,66.04 90 bottom
T2  269.24,27.94 90 bottom
T3  269.24,123.19 90 bottom
T4  269.24,180.34 90 bottom

### Tracks (layer width: path | path; a pad name or v marks a point on that pad's centre or on a via)
GND
  pour Bottom (isolate 0.406): 13.97,233.68 15.24,234.95 279.4,234.95 283.21,231.14 283.21,30.48 276.86,24.13 19.05,24.13 12.7,30.48 12.7,232.41
N$1
  Bottom 1.016: LED1.K LED2.A
N$2
  Bottom 1.016: LED4.K LED5.A
N$3
  Bottom 1.016: LED7.K LED8.A
N$4
  Bottom 1.016: LED10.K LED11.A
N$5
  Bottom 1.016: LED13.K LED14.A
N$6
  Bottom 1.016: LED16.K LED17.A
N$7
  Bottom 1.016: LED19.K LED20.A
N$8
  Bottom 1.016: LED22.K LED23.A
N$9
  Bottom 1.016: LED27.K LED26.A
N$10
  Bottom 1.016: LED30.K LED29.A
N$11
  Bottom 1.016: LED31.K LED32.A
N$12
  Bottom 1.016: LED36.K LED35.A
N$13
  Bottom 1.016: LED37.K LED38.A
N$14
  Bottom 1.016: LED40.K LED41.A
N$15
  Bottom 1.016: LED41.K LED42.A
N$16
  Bottom 1.016: LED38.K LED39.A
N$17
  Bottom 1.016: LED35.K LED34.A
N$18
  Bottom 1.016: LED32.K LED33.A
N$19
  Bottom 1.016: LED29.K LED28.A
N$20
  Bottom 1.016: LED26.K LED25.A
N$21
  Bottom 1.016: LED23.K LED24.A
N$22
  Bottom 1.016: LED20.K LED21.A
N$23
  Bottom 1.016: LED17.K LED18.A
N$24
  Bottom 1.016: LED14.K LED15.A
N$25
  Bottom 1.016: LED11.K LED12.A
N$26
  Bottom 1.016: LED8.K LED9.A
N$27
  Bottom 1.016: LED5.K LED6.A
N$28
  Bottom 1.016: LED2.K LED3.A
N$29
  Bottom 1.422: R1.1 19.05,184.15 20.32,182.88 36.51,182.88 R2.1 38.1,184.15 39.37,182.88 55.56,182.88 R3.1 57.15,184.15 58.42,182.88 74.61,182.88 R4.1 76.2,184.15 77.47,182.88 93.66,182.88 R5.1 95.25,184.15 96.52,182.88 112.71,182.88 R6.1 114.3,184.15 115.57,182.88 131.76,182.88 R7.1 133.35,184.15 134.62,182.88 150.81,182.88 R8.1 152.4,184.15 153.67,182.88 169.86,182.88 R9.1 171.45,184.15 172.72,182.88 188.91,182.88 R10.1 190.5,184.15 191.77,182.88 207.96,182.88 R11.1 209.55,184.15 210.82,182.88 227.01,182.88 R12.1 228.6,184.15 229.87,182.88 246.06,182.88 R13.1 247.65,184.15 248.92,182.88 265.11,182.88 265.27,183.04 | 265.27,183.04 R14.1 | T4.1 267.94,180.37 265.27,183.04
N$30
  Bottom 1.016: LED43.K LED44.A
N$31
  Bottom 1.016: LED46.K LED47.A
N$32
  Bottom 1.016: LED49.K LED50.A
N$33
  Bottom 1.016: LED52.K LED53.A
N$34
  Bottom 1.016: LED55.K LED56.A
N$35
  Bottom 1.016: LED58.K LED59.A
N$36
  Bottom 1.016: LED61.K LED62.A
N$37
  Bottom 1.016: LED64.K LED65.A
N$38
  Bottom 1.016: LED69.K LED68.A
N$39
  Bottom 1.016: LED72.K LED71.A
N$40
  Bottom 1.016: LED73.K LED74.A
N$41
  Bottom 1.016: LED78.K LED77.A
N$42
  Bottom 1.016: LED79.K LED80.A
N$43
  Bottom 1.016: LED82.K LED83.A
N$44
  Bottom 1.016: LED83.K LED84.A
N$45
  Bottom 1.016: LED80.K LED81.A
N$46
  Bottom 1.016: LED77.K LED76.A
N$47
  Bottom 1.016: LED74.K LED75.A
N$48
  Bottom 1.016: LED71.K LED70.A
N$49
  Bottom 1.016: LED68.K LED67.A
N$50
  Bottom 1.016: LED65.K LED66.A
N$51
  Bottom 1.016: LED62.K LED63.A
N$52
  Bottom 1.016: LED59.K LED60.A
N$53
  Bottom 1.016: LED56.K LED57.A
N$54
  Bottom 1.016: LED53.K LED54.A
N$55
  Bottom 1.016: LED50.K LED51.A
N$56
  Bottom 1.016: LED47.K LED48.A
N$57
  Bottom 1.016: LED44.K LED45.A
N$58
  Bottom 1.422: R15.1 19.05,127 20.32,125.73 36.51,125.73 R16.1 38.1,127 39.37,125.73 55.56,125.73 R17.1 58.74,125.73 74.93,125.73 76.2,127 R18.1 77.79,125.73 93.98,125.73 95.25,127 R19.1 96.84,125.73 113.03,125.73 114.3,127 R20.1 115.89,125.73 132.08,125.73 133.35,127 R21.1 134.94,125.73 151.13,125.73 152.4,127 R22.1 153.99,125.73 170.18,125.73 171.45,127 R23.1 173.04,125.73 189.23,125.73 190.5,127 R24.1 192.09,125.73 208.28,125.73 209.55,127 R25.1 211.14,125.73 227.33,125.73 228.6,127 R26.1 230.19,125.73 246.38,125.73 247.65,127 R27.1 249.24,125.73 265.43,125.73 | R28.1 266.7,127 265.43,125.73 | T3.1 267.94,123.22 265.43,125.73
N$59
  Bottom 1.016: LED85.K LED86.A
N$60
  Bottom 1.016: LED86.K LED87.A
N$61
  Bottom 1.016: LED88.K LED89.A
N$62
  Bottom 1.016: LED91.K LED92.A
N$63
  Bottom 1.016: LED94.K LED95.A
N$64
  Bottom 1.016: LED97.K LED98.A
N$65
  Bottom 1.016: LED100.K LED101.A
N$66
  Bottom 1.016: LED103.K LED104.A
N$67
  Bottom 1.016: LED106.K LED107.A
N$68
  Bottom 1.016: LED109.K LED110.A
N$69
  Bottom 1.016: LED112.K LED113.A
N$70
  Bottom 1.016: LED115.K LED116.A
N$71
  Bottom 1.016: LED118.K LED119.A
N$72
  Bottom 1.016: LED121.K LED122.A
N$73
  Bottom 1.016: LED124.K LED125.A
N$74
  Bottom 1.016: LED125.K LED126.A
N$75
  Bottom 1.016: LED122.K LED123.A
N$76
  Bottom 1.016: LED119.K LED120.A
N$77
  Bottom 1.016: LED116.K LED117.A
N$78
  Bottom 1.016: LED113.K LED114.A
N$79
  Bottom 1.016: LED110.K LED111.A
N$80
  Bottom 1.016: LED107.K LED108.A
N$81
  Bottom 1.016: LED104.K LED105.A
N$82
  Bottom 1.016: LED101.K LED102.A
N$83
  Bottom 1.016: LED98.K LED99.A
N$84
  Bottom 1.016: LED95.K LED96.A
N$85
  Bottom 1.016: LED92.K LED93.A
N$86
  Bottom 1.016: LED89.K LED90.A
N$87
  Bottom 1.422: R42.1 266.7,69.85 265.43,68.58 | 265.43,68.58 249.24,68.58 R41.1 247.65,69.85 246.38,68.58 230.19,68.58 R40.1 228.6,69.85 227.33,68.58 211.14,68.58 R39.1 209.55,69.85 208.28,68.58 192.09,68.58 R38.1 190.5,69.85 189.23,68.58 173.04,68.58 R37.1 171.45,69.85 170.18,68.58 153.99,68.58 R36.1 152.4,69.85 151.13,68.58 134.94,68.58 R35.1 133.35,69.85 132.08,68.58 115.89,68.58 R34.1 114.3,69.85 113.03,68.58 96.84,68.58 R33.1 95.25,69.85 93.98,68.58 77.79,68.58 R32.1 76.2,69.85 74.93,68.58 58.74,68.58 R31.1 57.15,69.85 55.88,68.58 39.69,68.58 R30.1 38.1,69.85 36.83,68.58 20.64,68.58 R29.1 | T1.1 267.94,66.06 265.43,68.58
N$88
  Bottom 1.016: LED127.K LED128.A
N$89
  Bottom 1.016: LED129.K LED130.A
N$90
  Bottom 1.016: LED131.K LED132.A
N$91
  Bottom 1.016: LED133.K LED134.A
N$92
  Bottom 1.016: LED135.K LED136.A
N$93
  Bottom 1.016: LED137.K LED138.A
N$94
  Bottom 1.016: LED139.K LED140.A
N$95
  Bottom 1.016: LED141.K LED142.A
N$96
  Bottom 1.016: LED143.K LED144.A
N$97
  Bottom 1.016: LED145.K LED146.A
N$98
  Bottom 1.016: LED147.K LED148.A
N$99
  Bottom 1.016: LED149.K LED150.A
N$100
  Bottom 1.016: LED151.K LED152.A
N$101
  Bottom 1.016: LED153.K LED154.A
N$102
  Bottom 1.422: R43.1 19.05,31.75 20.32,30.48 36.51,30.48 R44.1 38.1,31.75 39.37,30.48 55.56,30.48 R45.1 57.15,31.75 58.42,30.48 74.61,30.48 R46.1 76.2,31.75 77.47,30.48 93.66,30.48 R47.1 95.25,31.75 96.52,30.48 112.71,30.48 R48.1 114.3,31.75 115.57,30.48 131.76,30.48 R49.1 133.35,31.75 134.62,30.48 150.81,30.48 R50.1 152.4,31.75 153.67,30.48 169.86,30.48 R51.1 171.45,31.75 172.72,30.48 188.91,30.48 R52.1 190.5,31.75 191.77,30.48 207.96,30.48 R53.1 209.55,31.75 210.82,30.48 227.01,30.48 R54.1 228.6,31.75 229.87,30.48 246.06,30.48 R55.1 247.65,31.75 248.92,30.48 265.11,30.48 265.27,30.64 | 265.27,30.64 R56.1 | T2.1 267.94,27.96 265.27,30.64
N$103  (via drill 0.8 pad 1.68)
  Top 1.016: v270.51,71.12 270.51,72.39 271.78,73.66 279.4,73.66 v280.67,74.93
  Bottom 1.016: T1.3 270.26,67.06 270.51,67.31 v270.51,71.12 | v280.67,74.93 280.67,218.44 279.4,219.71 JP2.3
N$104  (via drill 0.8 pad 1.68)
  Top 1.016: v275.59,176.53 275.59,177.8 280.67,182.88 280.67,220.98 v279.4,222.25
  Bottom 1.016: R57.2 v275.59,176.53 | v279.4,222.25 JP2.5
N$106
  Bottom 1.016: LED42.K R14.2
N$107
  Bottom 1.016: LED39.K R13.2
N$108
  Bottom 1.016: LED34.K R12.2
N$109
  Bottom 1.016: LED33.K R11.2
N$110
  Bottom 1.016: LED28.K R10.2
N$111
  Bottom 1.016: R9.2 LED25.K
N$112
  Bottom 1.016: LED24.K R8.2
N$113
  Bottom 1.016: LED21.K R7.2
N$114
  Bottom 1.016: LED18.K R6.2
N$115
  Bottom 1.016: LED15.K R5.2
N$116
  Bottom 1.016: LED12.K R4.2
N$117
  Bottom 1.016: LED9.K R3.2
N$118
  Bottom 1.016: LED6.K R2.2
N$119
  Bottom 1.016: LED3.K R1.2
N$120
  Bottom 1.016: LED45.K R15.2
N$121
  Bottom 1.016: R16.2 LED48.K
N$122
  Bottom 1.016: LED51.K R17.2
N$123
  Bottom 1.016: LED54.K R18.2
N$124
  Bottom 1.016: LED57.K R19.2
N$125
  Bottom 1.016: LED60.K R20.2
N$126
  Bottom 1.016: LED63.K R21.2
N$127
  Bottom 1.016: R22.2 LED66.K
N$128
  Bottom 1.016: R23.2 LED67.K
N$129
  Bottom 1.016: R24.2 LED70.K
N$130
  Bottom 1.016: R25.2 LED75.K
N$131
  Bottom 1.016: R26.2 LED76.K
N$132
  Bottom 1.016: R27.2 LED81.K
N$133
  Bottom 1.016: R28.2 LED84.K
N$134
  Bottom 1.016: R29.2 LED87.K
N$135
  Bottom 1.016: R30.2 LED90.K
N$136
  Bottom 1.016: R31.2 LED93.K
N$137
  Bottom 1.016: R32.2 LED96.K
N$138
  Bottom 1.016: R33.2 LED99.K
N$139
  Bottom 1.016: R34.2 LED102.K
N$140
  Bottom 1.016: R35.2 LED105.K
N$141
  Bottom 1.016: LED108.K R36.2
N$142
  Bottom 1.016: LED111.K R37.2
N$143
  Bottom 1.016: R38.2 LED114.K
N$144
  Bottom 1.016: R39.2 LED117.K
N$145
  Bottom 1.016: R40.2 LED120.K
N$146
  Bottom 1.016: R41.2 LED123.K
N$147
  Bottom 1.016: R42.2 LED126.K
N$148
  Bottom 1.016: R43.2 LED128.K
N$149
  Bottom 1.016: R44.2 LED130.K
N$150
  Bottom 1.016: R45.2 LED132.K
N$151
  Bottom 1.016: R46.2 LED134.K
N$152
  Bottom 1.016: R47.2 LED136.K
N$153
  Bottom 1.016: R48.2 LED138.K
N$154
  Bottom 1.016: R49.2 LED140.K
N$155
  Bottom 1.016: R50.2 LED142.K
N$156
  Bottom 1.016: R51.2 LED144.K
N$157
  Bottom 1.016: R52.2 LED146.K
N$158
  Bottom 1.016: R53.2 LED148.K
N$159
  Bottom 1.016: R54.2 LED150.K
N$160
  Bottom 1.016: R55.2 LED152.K
N$161
  Bottom 1.016: R56.2 LED154.K
N$163  (via drill 0.8 pad 1.68)
  Top 1.016: v270.51,31.75 270.51,33.02 271.78,34.29 278.13,34.29 v279.4,35.56
  Bottom 1.016: T2.3 270.26,28.96 270.51,29.21 v270.51,31.75 | v279.4,35.56 279.4,71.12 278.13,72.39 278.13,214.63 JP2.1
N$165
  Bottom 1.016: T4.2 271.45,179.4 273.05,177.8 273.05,152.4 | 273.05,152.4 273.05,121.92 | 273.05,121.92 273.05,64.77 | 273.05,64.77 273.05,27.94 271.78,26.67 270.59,26.67 T2.2 | T1.2 272.72,65.1 273.05,64.77 | T3.2 272.72,122.25 273.05,121.92 | JP1.1 273.05,64.77 | R57.1 275.59,153.67 274.32,152.4 273.05,152.4
N$166  (via drill 0.8 pad 1.68)
  Top 1.016: v270.51,176.53 v274.32,180.34
  Bottom 1.016: T3.3 270.26,124.21 270.51,124.46 v270.51,176.53 | v274.32,180.34 274.32,182.88 273.05,184.15 JP2.2
N$167
  Bottom 1.016: JP2.4 270.51,219.71 269.24,218.44 269.24,213.36 270.51,212.09 270.51,181.59 T4.3
VCC
  Bottom 1.422: LED153.A 266.7,59.69 265.43,60.96 247.65,60.96 | 247.65,60.96 228.6,60.96 | 228.6,60.96 209.55,60.96 | 209.55,60.96 190.5,60.96 | 190.5,60.96 171.45,60.96 | 171.45,60.96 152.4,60.96 | 152.4,60.96 133.35,60.96 | 133.35,60.96 114.3,60.96 | 114.3,60.96 95.25,60.96 | 95.25,60.96 76.2,60.96 | 76.2,60.96 57.15,60.96 | 57.15,60.96 38.1,60.96 | 21.59,60.96 LED127.A | LED131.A 57.15,60.96 | LED133.A 76.2,60.96 | LED135.A 95.25,60.96 | LED137.A 114.3,60.96 | LED139.A 133.35,60.96 | LED141.A 152.4,60.96 | LED143.A 171.45,60.96 | LED145.A 190.5,60.96 | LED147.A 209.55,60.96 | LED149.A 228.6,60.96 | LED151.A 247.65,60.96 | LED124.A 266.7,116.84 265.43,118.11 247.65,118.11 | 247.65,118.11 228.6,118.11 | 228.6,118.11 209.55,118.11 | 209.55,118.11 190.5,118.11 | 190.5,118.11 171.45,118.11 | 171.45,118.11 152.4,118.11 | 152.4,118.11 133.35,118.11 | 133.35,118.11 114.3,118.11 | 114.3,118.11 95.25,118.11 | 95.25,118.11 76.2,118.11 | 76.2,118.11 57.15,118.11 | 57.15,118.11 38.1,118.11 | 38.1,118.11 21.59,118.11 | LED88.A 38.1,118.11 | LED91.A 57.15,118.11 | LED94.A 76.2,118.11 | LED97.A 95.25,118.11 | LED100.A 114.3,118.11 | LED103.A 133.35,118.11 | LED106.A 152.4,118.11 | LED109.A 171.45,118.11 | LED112.A 190.5,118.11 | LED115.A 209.55,118.11 | LED118.A 228.6,118.11 | LED121.A 247.65,118.11 | LED82.A 266.7,173.99 265.43,175.26 247.65,175.26 | 247.65,175.26 228.6,175.26 | 228.6,175.26 209.55,175.26 | 209.55,175.26 190.5,175.26 | 190.5,175.26 171.45,175.26 | 171.45,175.26 152.4,175.26 | 152.4,175.26 133.35,175.26 | 133.35,175.26 114.3,175.26 | 114.3,175.26 95.25,175.26 | 95.25,175.26 76.2,175.26 | 76.2,175.26 57.15,175.26 | 57.15,175.26 38.1,175.26 | 38.1,175.26 21.59,175.26 LED43.A
  Bottom 1.422: LED46.A 38.1,175.26 | LED49.A 57.15,175.26 | LED52.A 76.2,175.26 | LED55.A 95.25,175.26 | LED58.A 114.3,175.26 | LED61.A 133.35,175.26 | LED64.A 152.4,175.26 | LED69.A 171.45,175.26 | LED72.A 190.5,175.26 | LED73.A 209.55,175.26 | LED78.A 228.6,175.26 | LED79.A 247.65,175.26 | 265.43,232.41 247.65,232.41 | 247.65,232.41 228.6,232.41 | 228.6,232.41 209.55,232.41 | 209.55,232.41 190.5,232.41 | 190.5,232.41 171.45,232.41 | 171.45,232.41 152.4,232.41 | 152.4,232.41 133.35,232.41 | 133.35,232.41 114.3,232.41 | 114.3,232.41 95.25,232.41 | 95.25,232.41 76.2,232.41 | 76.2,232.41 57.15,232.41 | 57.15,232.41 38.1,232.41 | 38.1,232.41 21.59,232.41 | 21.59,232.41 LED1.A | LED4.A 38.1,232.41 | LED7.A 57.15,232.41 | LED10.A 76.2,232.41 | LED13.A 95.25,232.41 | LED16.A 114.3,232.41 | LED19.A 133.35,232.41 | LED22.A 152.4,232.41 | LED27.A 171.45,232.41 | LED30.A 190.5,232.41 | LED31.A 209.55,232.41 | LED36.A 228.6,232.41 | LED37.A 247.65,232.41 | LED129.A 38.1,60.96 | 38.1,60.96 21.59,60.96 | 21.59,60.96 15.24,67.31 15.24,118.11 | 15.24,118.11 15.24,175.26 | 15.24,175.26 15.24,231.14 16.51,232.41 21.59,232.41 | 114.3,175.26 15.24,175.26 | LED85.A 21.59,118.11 | 21.59,118.11 15.24,118.11 | 274.32,231.14 JP2.14 265.43,232.41 | 274.32,231.14 JP2.11 | JP2.13 274.32,231.14 | 274.32,231.14 JP2.12 | LED40.A 266.7,231.14 265.43,232.41